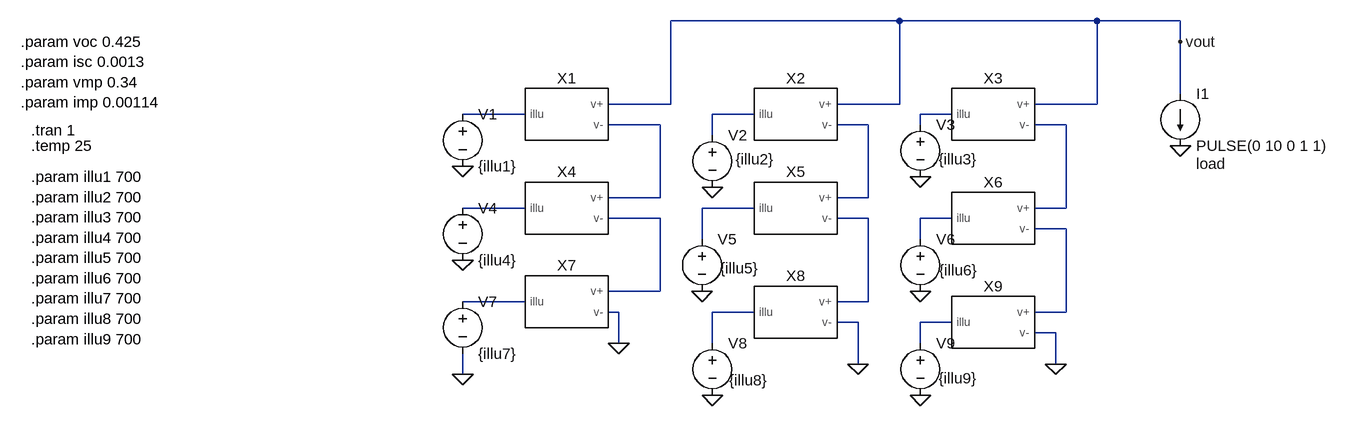
[diagram p0: schematic NineCell.asc]
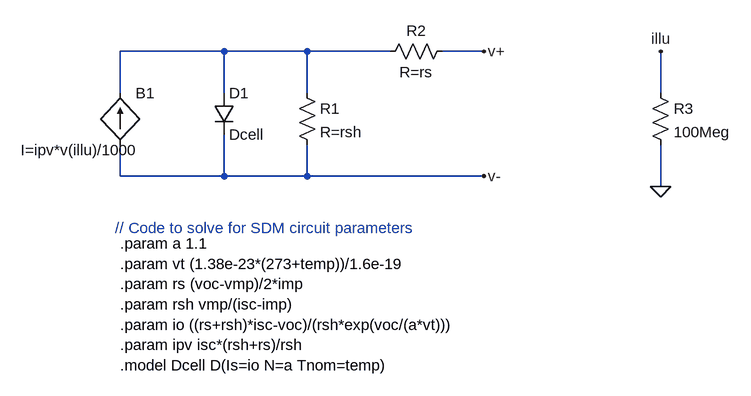
[diagram p1: sub-circuit ltspicemodel.asc]
NineCell.asc, the LTspice schematic file:
Version 4
SHEET 1 1312 680
WIRE 640 -288 288 -288
WIRE 944 -288 640 -288
WIRE 1072 -288 944 -288
WIRE 1072 -256 1072 -288
WIRE 1072 -176 1072 -256
WIRE 288 -160 288 -288
WIRE 288 -160 192 -160
WIRE 640 -160 640 -288
WIRE 640 -160 544 -160
WIRE 944 -160 944 -288
WIRE 944 -160 848 -160
WIRE 64 -144 -32 -144
WIRE 416 -144 352 -144
WIRE 720 -144 672 -144
WIRE 272 -128 192 -128
WIRE 592 -128 544 -128
WIRE 672 -128 672 -144
WIRE 896 -128 848 -128
WIRE 352 -112 352 -144
WIRE 272 -16 272 -128
WIRE 272 -16 192 -16
WIRE 592 -16 592 -128
WIRE 592 -16 544 -16
WIRE 64 0 -32 0
WIRE 416 0 336 0
WIRE 896 0 896 -128
WIRE 896 0 848 0
WIRE 272 16 192 16
WIRE 592 16 544 16
WIRE 720 16 672 16
WIRE 896 32 848 32
WIRE 336 48 336 0
WIRE 672 48 672 16
WIRE 272 128 272 16
WIRE 272 128 192 128
WIRE 64 144 -32 144
WIRE 592 144 592 16
WIRE 592 144 544 144
WIRE 208 160 192 160
WIRE 416 160 352 160
WIRE 896 160 896 32
WIRE 896 160 848 160
WIRE 576 176 544 176
WIRE 720 176 672 176
WIRE 880 192 848 192
WIRE 208 208 208 160
WIRE 352 208 352 160
WIRE 672 208 672 176
WIRE 576 240 576 176
WIRE 880 240 880 192
WIRE -32 256 -32 224
FLAG 1072 -96 0
FLAG -32 256 0
FLAG 208 208 0
FLAG 576 240 0
FLAG 880 240 0
FLAG -32 80 0
FLAG -32 -64 0
FLAG 352 288 0
FLAG 336 128 0
FLAG 352 -32 0
FLAG 672 288 0
FLAG 672 128 0
FLAG 672 -48 0
FLAG 1072 -256 vout
SYMBOL LTspiceModel 128 144 R0
SYMATTR InstName X7
SYMBOL voltage -32 128 R0
WINDOW 123 0 0 Left 0
WINDOW 39 0 0 Left 0
SYMATTR InstName V7
SYMATTR Value {illu7}
SYMBOL current 1072 -176 R0
WINDOW 123 0 0 Left 0
WINDOW 39 24 108 Left 2
SYMATTR SpiceLine load
SYMATTR InstName I1
SYMATTR Value PULSE(0 10 0 1 1)
SYMBOL LTspiceModel 128 0 R0
SYMATTR InstName X4
SYMBOL LTspiceModel 128 -144 R0
SYMATTR InstName X1
SYMBOL LTspiceModel 480 160 R0
SYMATTR InstName X8
SYMBOL LTspiceModel 480 0 R0
SYMATTR InstName X5
SYMBOL LTspiceModel 480 -144 R0
SYMATTR InstName X2
SYMBOL LTspiceModel 784 176 R0
SYMATTR InstName X9
SYMBOL LTspiceModel 784 16 R0
SYMATTR InstName X6
SYMBOL LTspiceModel 784 -144 R0
SYMATTR InstName X3
SYMBOL voltage -32 -16 R0
WINDOW 123 0 0 Left 0
WINDOW 39 0 0 Left 0
SYMATTR InstName V4
SYMATTR Value {illu4}
SYMBOL voltage -32 -160 R0
WINDOW 123 0 0 Left 0
WINDOW 39 0 0 Left 0
SYMATTR InstName V1
SYMATTR Value {illu1}
SYMBOL voltage 352 192 R0
WINDOW 123 0 0 Left 0
WINDOW 39 0 0 Left 0
WINDOW 3 26 73 Left 2
SYMATTR InstName V8
SYMATTR Value {illu8}
SYMBOL voltage 336 32 R0
WINDOW 123 0 0 Left 0
WINDOW 39 0 0 Left 0
WINDOW 3 28 61 Left 2
SYMATTR InstName V5
SYMATTR Value {illu5}
SYMBOL voltage 352 -128 R0
WINDOW 123 0 0 Left 0
WINDOW 39 0 0 Left 0
WINDOW 3 36 53 Left 2
SYMATTR InstName V2
SYMATTR Value {illu2}
SYMBOL voltage 672 192 R0
WINDOW 123 0 0 Left 0
WINDOW 39 0 0 Left 0
WINDOW 3 28 70 Left 2
SYMATTR InstName V9
SYMATTR Value {illu9}
SYMBOL voltage 672 32 R0
WINDOW 123 0 0 Left 0
WINDOW 39 0 0 Left 0
WINDOW 3 29 64 Left 2
SYMATTR InstName V6
SYMATTR Value {illu6}
SYMBOL voltage 672 -144 R0
WINDOW 123 0 0 Left 0
WINDOW 39 0 0 Left 0
WINDOW 3 28 69 Left 2
SYMATTR InstName V3
SYMATTR Value {illu3}
TEXT -712 -256 Left 2 !.param voc 0.425\n.param isc 0.0013\n.param vmp 0.34\n.param imp 0.00114
TEXT -696 -120 Left 2 !.tran 1
TEXT -696 -96 Left 2 !.temp 25
TEXT -696 -48 Left 2 !.param illu1 700\n.param illu2 700\n.param illu3 700\n.param illu4 700\n.param illu5 700\n.param illu6 700\n.param illu7 700\n.param illu8 700\n.param illu9 700

ltspicemodel.asc, the sub-circuit schematic file:
Version 4
SHEET 1 1464 680
WIRE 336 48 176 48
WIRE 464 48 336 48
WIRE 592 48 464 48
WIRE 736 48 672 48
WIRE 176 112 176 48
WIRE 336 112 336 48
WIRE 464 112 464 48
WIRE 1008 112 1008 48
WIRE 176 240 176 192
WIRE 336 240 336 176
WIRE 336 240 176 240
WIRE 464 240 464 192
WIRE 464 240 336 240
WIRE 736 240 464 240
WIRE 1008 256 1008 192
FLAG 736 48 v+
FLAG 736 240 v-
FLAG 1008 256 0
FLAG 1008 48 illu
SYMBOL bi2 176 112 R0
WINDOW 3 -153 88 Left 2
SYMATTR Value I=ipv*v(illu)/1000
SYMATTR InstName B1
SYMBOL diode 320 112 R0
SYMATTR InstName D1
SYMATTR Value Dcell
SYMBOL res 448 96 R0
SYMATTR InstName R1
SYMATTR Value R=rsh
SYMBOL res 688 32 R90
WINDOW 0 0 56 VBottom 2
WINDOW 3 32 56 VTop 2
SYMATTR InstName R2
SYMATTR Value R=rs
SYMBOL res 992 96 R0
SYMATTR InstName R3
SYMATTR Value 100Meg
TEXT 176 344 Left 2 !.param a 1.1\n.param vt (1.38e-23*(273+temp))/1.6e-19\n.param rs (voc-vmp)/2*imp\n.param rsh vmp/(isc-imp)\n.param io ((rs+rsh)*isc-voc)/(rsh*exp(voc/(a*vt)))\n.param ipv isc*(rsh+rs)/rsh\n.model Dcell D(Is=io N=a Tnom=temp)
TEXT 168 320 Left 2 ;// Code to solve for SDM circuit parameters

The netlist it stands for:
* NineCell.asc
XX7 N013 N009 0 ltspicemodel
V7 N013 0 {illu7}
I1 vout 0 PULSE(0 10 0 1 1) load
XX4 N007 N004 N009 ltspicemodel
XX1 N001 vout N004 ltspicemodel
XX8 N014 N010 0 ltspicemodel
XX5 N008 N005 N010 ltspicemodel
XX2 N002 vout N005 ltspicemodel
XX9 N015 N012 0 ltspicemodel
XX6 N011 N006 N012 ltspicemodel
XX3 N003 vout N006 ltspicemodel
V4 N007 0 {illu4}
V1 N001 0 {illu1}
V8 N014 0 {illu8}
V5 N008 0 {illu5}
V2 N002 0 {illu2}
V9 N015 0 {illu9}
V6 N011 0 {illu6}
V3 N003 0 {illu3}

* block symbol definitions
.subckt ltspicemodel illu v+ v-
B1 v- N001 I=ipv*v(illu)/1000
D1 N001 v- Dcell
R1 N001 v- R=rsh
R2 v+ N001 R=rs
R3 illu 0 100Meg
.param a 1.1
.param vt (1.38e-23*(273+temp))/1.6e-19
.param rs (voc-vmp)/2*imp
.param rsh vmp/(isc-imp)
.param io ((rs+rsh)*isc-voc)/(rsh*exp(voc/(a*vt)))
.param ipv isc*(rsh+rs)/rsh
.model Dcell D(Is=io N=a Tnom=temp)
* // Code to solve for SDM circuit parameters
.ends ltspicemodel

.model D D
.lib standard.dio
.param voc 0.425
.param isc 0.0013
.param vmp 0.34
.param imp 0.00114
.tran 1
.temp 25
.param illu1 700
.param illu2 700
.param illu3 700
.param illu4 700
.param illu5 700
.param illu6 700
.param illu7 700
.param illu8 700
.param illu9 700
.backanno
.end